# Altium schematic sheet 21_Camera MIPI CSI.schdoc.schdoc
size 309 x 223 mm; Symbol: Sheet-Symbol_A4; Device: Sheet-Symbol_A4; Company: 嘉立创EDA; Version: V1.0; Page Size: A4; @Project Name: RK3568底板_V1.2; @Page Count: 6; @Update Date: 2024-04-19; @Create Date: 2024-04-18; @Schematic Name: 原理图; @Page No: 3; @Page Name: 外设接口
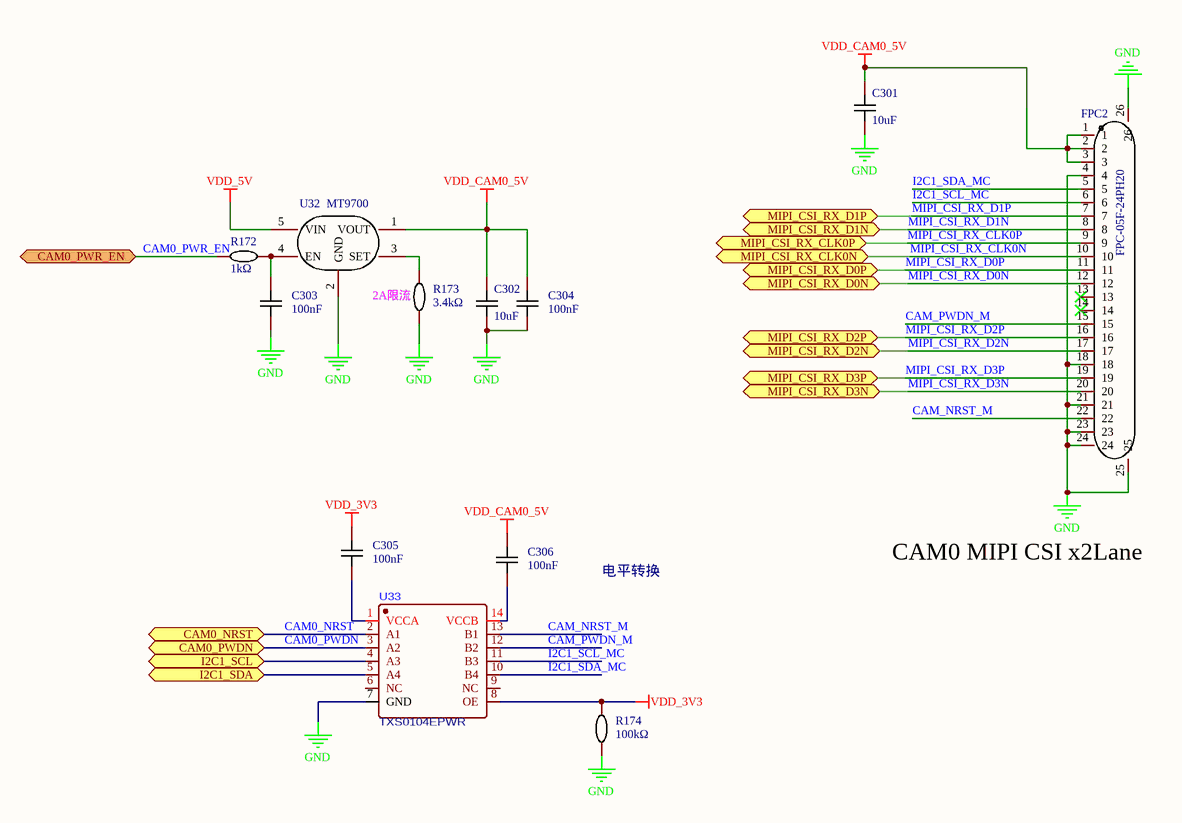
[diagram p0: 21_Camera MIPI CSI.schdoc.schdoc]

## Parts
C301  10uF  [C0603]
C302  10uF  [C0603]
C303  100nF  [C0603]
C304  100nF  [C0603]
C305  100nF  [C0603]
C306  100nF  [C0603]
FPC2  FPC-05F-24PH20  [FPC-SMD_24P-P0.50_FPC-05F-24PH20]
R172  1kΩ  [R0603]
R173  3.4kΩ  [R0603]
R174  100kΩ  [R0603]
U32  MT9700  [SOT-23-5_L3.0-W1.7-P0.95-LS2.8-BR]
U33  TXS0104EPWR  [TSSOP-14_L5.0-W4.4-P0.65-LS6.4-BL]

## Ports
CAM0_NRST (bidir), CAM0_PWDN (bidir), CAM0_PWR_EN (bidir), I2C1_SCL (bidir), I2C1_SDA (bidir), MIPI_CSI_RX_CLK0N (bidir), MIPI_CSI_RX_CLK0P (bidir), MIPI_CSI_RX_D0N (bidir), MIPI_CSI_RX_D0P (bidir), MIPI_CSI_RX_D1N (bidir), MIPI_CSI_RX_D1P (bidir), MIPI_CSI_RX_D2N (bidir), MIPI_CSI_RX_D2P (bidir), MIPI_CSI_RX_D3N (bidir), MIPI_CSI_RX_D3P (bidir)

## Nets
GND: C301.1 C302.1 C303.1 C304.1 FPC2.4 FPC2.18 FPC2.21 FPC2.23 FPC2.24 FPC2.25 FPC2.26 R173.1 R174.1 U32.2(GND) U33.7(GND)
VDD_3V3: C305.2 R174.2 U33.8(OE)
VDD_5V: U32.5(VIN)
VDD_CAM0_5V: C301.2 C302.2 C304.2 C306.2 FPC2.1 FPC2.2 FPC2.3 U32.1(VOUT)
CAM0_NRST: U33.2(A1) ; port CAM0_NRST
CAM0_PWDN: U33.3(A2) ; port CAM0_PWDN
CAM0_PWR_EN: R172.1 ; port CAM0_PWR_EN
CAM_NRST_M: FPC2.22 U33.13(B1)
CAM_PWDN_M: FPC2.15 U33.12(B2)
I2C1_SCL: U33.4(A3) ; port I2C1_SCL
I2C1_SCL_MC: FPC2.6 U33.11(B3)
I2C1_SDA: U33.5(A4) ; port I2C1_SDA
I2C1_SDA_MC: FPC2.5 U33.10(B4)
MIPI_CSI_RX_CLK0N: FPC2.10 ; port MIPI_CSI_RX_CLK0N
MIPI_CSI_RX_CLK0P: FPC2.9 ; port MIPI_CSI_RX_CLK0P
MIPI_CSI_RX_D0N: FPC2.12 ; port MIPI_CSI_RX_D0N
MIPI_CSI_RX_D0P: FPC2.11 ; port MIPI_CSI_RX_D0P
MIPI_CSI_RX_D1N: FPC2.8 ; port MIPI_CSI_RX_D1N
MIPI_CSI_RX_D1P: FPC2.7 ; port MIPI_CSI_RX_D1P
MIPI_CSI_RX_D2N: FPC2.17 ; port MIPI_CSI_RX_D2N
MIPI_CSI_RX_D2P: FPC2.16 ; port MIPI_CSI_RX_D2P
MIPI_CSI_RX_D3N: FPC2.20 ; port MIPI_CSI_RX_D3N
MIPI_CSI_RX_D3P: FPC2.19 ; port MIPI_CSI_RX_D3P
NetC303_2: C303.2 R172.2 U32.4(EN)
NetC305_1: C305.1 U33.1(VCCA)
NetC306_1: C306.1 U33.14(VCCB)
NetR173_2: R173.2 U32.3(SET)

Not connected (* = marked no-connect by the designer): FPC2 13* 14*; U33 6(NC) 9(NC)

## Notes on the sheet
- 2A限流
- 电平转换
- CAM0 MIPI CSI x2Lane
- 1
- 2
- 3
- 4
- 5
- 6
- A
- B
- C
- 原理图
- 创建日期
- 更新日期
- 2024-04-19
- 2024-04-18
- 审阅
- 绘制
- 图页
- 外设接口
- 物料编码
- RK3568底板_V1.2
- D
- 版本
- 尺寸
- 页
- 共
- V1.0
- A4
- 嘉立创EDA

## Library data of the parts
C301 C302 = CL10A106KP8NNNC: Manufacturer: SAMSUNG(三星); Add into BOM: yes; Tolerance: ±10%; Voltage Rated: 10V; Temperature Coefficient: X5R; Name: 10uF; Symbol: CL10A106KP8NNNC; Device: CL10A106KP8NNNC; Supplier: LCSC; Manufacturer Part: CL10A106KP8NNNC; Value: 10uF; Supplier Part: C19702; JLCPCB Part Class: 基础库; LCSC Part Name: 10uF ±10% 10V; Supplier Footprint: 0603; Datasheet: https://atta.szlcsc.com/upload/public/pdf/source/20160218/1457707763339.pdf; Convert to PCB: yes
C303-C306 = CC0603KRX7R9BB104: Manufacturer: YAGEO(国巨); Add into BOM: yes; Tolerance: ±10%; Voltage Rated: 50V; Temperature Coefficient: X7R; Name: 100nF; Symbol: CC0603KRX7R9BB104; Device: CC0603KRX7R9BB104; Supplier: LCSC; Manufacturer Part: CC0603KRX7R9BB104; Value: 100nF; Supplier Part: C14663; JLCPCB Part Class: 基础库; LCSC Part Name: 100nF ±10% 50V; Supplier Footprint: 0603; Datasheet: https://atta.szlcsc.com/upload/public/pdf/source/20180910/C282072_33301C7F631E79921B82A8DAC6BCC5B3.pdf; Convert to PCB: yes
FPC2 = FPC-05F-24PH20: Manufacturer: XUNPU(讯普); Add into BOM: yes; Locking Feature: 翻盖式; Number of Contacts: 24P; Pitch: 0.5mm; FFC, FCB Thickness: 0.3mm; Name: FPC-05F-24PH20; Symbol: FPC-05F-24PH20; Device: FPC-05F-24PH20; Supplier: LCSC; Supplier Part: C2856805; Manufacturer Part: FPC-05F-24PH20; JLCPCB Part Class: 扩展库; LCSC Part Name: 间距:0.5mm P数:24P 翻盖式 下接; Supplier Footprint: SMD,P=0.5mm,卧贴; Datasheet: https://atta.szlcsc.com/upload/public/pdf/source/20210922/C2856805_8542C20E2D7FF0FC4EEBD919AE0F6905.pdf; Convert to PCB: yes; Contact Type: 下接; Mounting Type: 卧贴; Height Above Board: 2mm; Operating Temperature Range: -25℃~+85℃
R172 = RC0603FR-071KL: Manufacturer: YAGEO(国巨); Add into BOM: yes; Tolerance: ±1%; Power(Watts): 100mW; Overload Voltage (Max): 75V; Temperature Coefficient: ±100ppm/℃; Name: 1kΩ; Symbol: RC0603FR-071KL; Device: RC0603FR-071KL; LCSC Part Name: 厚膜电阻 1kΩ ±1% 100mW; Supplier Part: C22548; Manufacturer Part: RC0603FR-071KL; Supplier Footprint: 0603; JLCPCB Part Class: 扩展库; Datasheet: https://atta.szlcsc.com/upload/public/pdf/source/20180316/70C0E2BDAE7FCC62C531A5A58D202EE1.pdf; Supplier: LCSC; Convert to PCB: yes; Type: 厚膜电阻; Value: 1kΩ; Operating Temperature Range: -55℃~+155℃
R173 = 0603WAF3401T5E: Manufacturer: UNI-ROYAL(厚声); Add into BOM: yes; Tolerance: ±1%; Power(Watts): 100mW; Overload Voltage (Max): 75V; Temperature Coefficient: ±100ppm/℃; Name: 3.4kΩ; Symbol: 0603WAF3401T5E; Device: 0603WAF3401T5E; Supplier: LCSC; Manufacturer Part: 0603WAF3401T5E; Supplier Part: C22997; Value: 3.4kΩ; JLCPCB Part Class: 扩展库; LCSC Part Name: 3.4kΩ ±1% 100mW 厚膜电阻; Supplier Footprint: 0603; Datasheet: https://atta.szlcsc.com/upload/public/pdf/source/20200306/C422600_1E6D84923E4A46A82E41ADD87F860B5C.pdf; Convert to PCB: yes; Type: 厚膜电阻; Operating Temperature Range: -55℃~+155℃
R174 = 0603WAF1003T5E: Manufacturer: UNI-ROYAL(厚声); Add into BOM: yes; Tolerance: ±1%; Power(Watts): 100mW; Overload Voltage (Max): 75V; Temperature Coefficient: ±100ppm/℃; Name: 100kΩ; Symbol: 0603WAF1003T5E; Device: 0603WAF1003T5E; LCSC Part Name: 100kΩ ±1% 100mW 厚膜电阻; Supplier Part: C25803; Manufacturer Part: 0603WAF1003T5E; Supplier Footprint: 0603; JLCPCB Part Class: 基础库; Datasheet: https://atta.szlcsc.com/upload/public/pdf/source/20200306/C422600_1E6D84923E4A46A82E41ADD87F860B5C.pdf; Supplier: LCSC; Convert to PCB: yes; Type: 厚膜电阻; Value: 100kΩ; Operating Temperature Range: -55℃~+155℃
U32 = MT9700: Manufacturer: 西安航天民芯; Add into BOM: yes; Name: MT9700; Symbol: MT9700; Device: MT9700; LCSC Part Name: MT9700; Supplier Part: C89855; Manufacturer Part: MT9700; Supplier Footprint: SOT-23-5; JLCPCB Part Class: 扩展库; Datasheet: https://atta.szlcsc.com/upload/public/pdf/source/20170418/1492481333031.pdf; Supplier: LCSC; Convert to PCB: yes